# Altium schematic sheet MAX17055.SchDoc
size A4; Organization: Altium Limited; Address1: L3, 12a Rodborough Rd; Address2: Frenchs Forest; Address3: NSW; Address4: Australia 2086
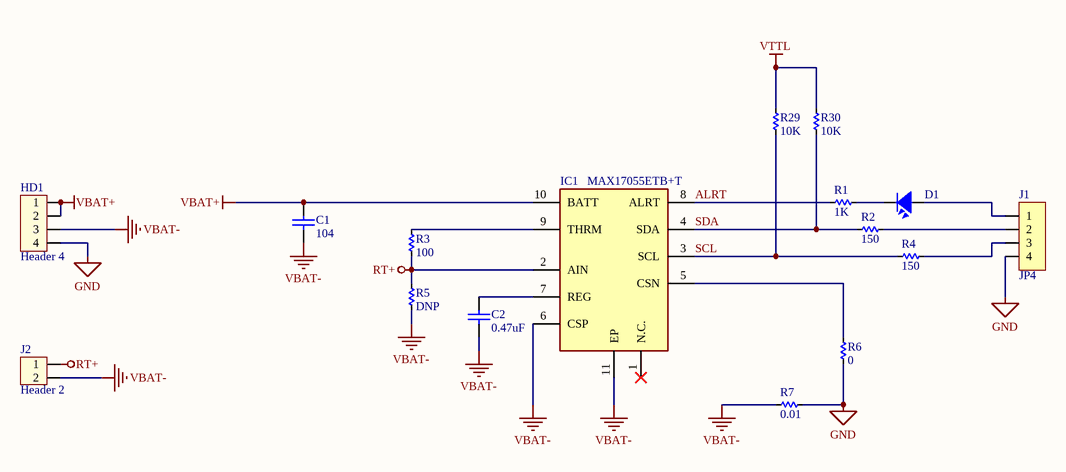
[diagram p0: MAX17055.SchDoc]

## Parts
C1  104  [0805 CAP]
C2  0.47uF  [0805 CAP]
D1  LED  [LED-0805-Green]  (value not drawn)
HD1  Header 4  [HED4]
IC1  MAX17055ETB+T  [SON40P250X200X80-11N]
J1  JP4  [JP4-C1T]
J2  Header 2  [HED2B]
R1  1K  [RES-SMD-0805]
R2  150  [RES-SMD-0805]
R3  100  [RES-SMD-0805]
R4  150  [RES-SMD-0805]
R5  DNP  [RES-SMD-0805]
R6  0  [RES-SMD-0805]
R7  0.01  [RES-SMD-0805]
R29  10K  [RES-SMD-0805]
R30  10K  [RES-SMD-0805]

## Nets
GND: HD1.4 J1.4 R6.2 R7.1
RT+: IC1.2(AIN) J2.1 R3.1 R5.2
VBAT+: C1.2 HD1.1 HD1.2 IC1.10(BATT)
VBAT-: C1.1 C2.1 HD1.3 IC1.6(CSP) IC1.11(EP) J2.2 R5.1 R7.2
VTTL: R29.2 R30.2
ALRT: IC1.8(ALRT) R1.1
SCL: IC1.3(SCL) R4.1 R29.1
SDA: IC1.4(SDA) R2.1 R30.1
NetC2_2: C2.2 IC1.7(REG)
NetD1_1: D1.1 J1.1
NetD1_2: D1.2 R1.2
NetIC1_5: IC1.5(CSN) R6.1
NetIC1_9: IC1.9(THRM) R3.2
NetJ1_2: J1.2 R2.2
NetJ1_3: J1.3 R4.2

Not connected (* = marked no-connect by the designer): IC1 1(N.C.)*

## Notes on the sheet
- Title
- Size:
- Date:
- A4
- Number:
- Time:
- Revision:
- Sheet
- of
- File:

## Library data of the parts
C1 C2 = CAP CERAMIC: Published: 8-Jun-2000; LatestRevisionDate: 17-Jul-2002; LatestRevisionNote: Re-released for DXP Platform.; PackageReference: RAD-0.3; Publisher: Altium Limited
D1 = LED SMD: Value: LED 3 - 5 ly 2 Colour
HD1 = Hed4: Header 4 (Green); Value: Header 4
IC1 = MAX17055ETB+T: Integrated Circuit; Manufacturer_Name: Maxim Integrated; Datasheet Link: https://datasheets.maximintegrated.com/en/ds/MAX17055.pdf; Height: 0.8mm; Manufacturer_Part_Number: MAX17055ETB+T; Arrow Part Number: MAX17055ETB+T; Mouser Part Number: 700-MAX17055ETB+T; Mouser Price/Stock: https://www.mouser.co.uk/ProductDetail/Maxim-Integrated/MAX17055ETB%2bT?qs=u4fy%2FsgLU9MiRW9MH4Zm9g%3D%3D
J1 = JP4: WR-PHD 2.54 mm Angled Socket Header; Manufacturer: W¨¹rth Elektronik eiSos GmbH; partNo: 613004143121; ComponentLink1 Description: Manufacturer; ComponentLink2 Description: Datasheet; NoPins: 04; Created Date: 29 March 2013; ComponentLink1URL: http://www.we-online.com; ComponentLink2URL: http://katalog.we-online.de/em/datasheet/6130xx143121.pdf; Created by: Karrer Zheng
J2 = Hed2: Header 2 (Green); Value: Header 2
R1-R7 R29 R30 = Res-SMD: Resistor; Manufacturer: Generic Components; Class: Passive; Published: 08/06/2000; Publisher: Altium Hobart Technology Centre